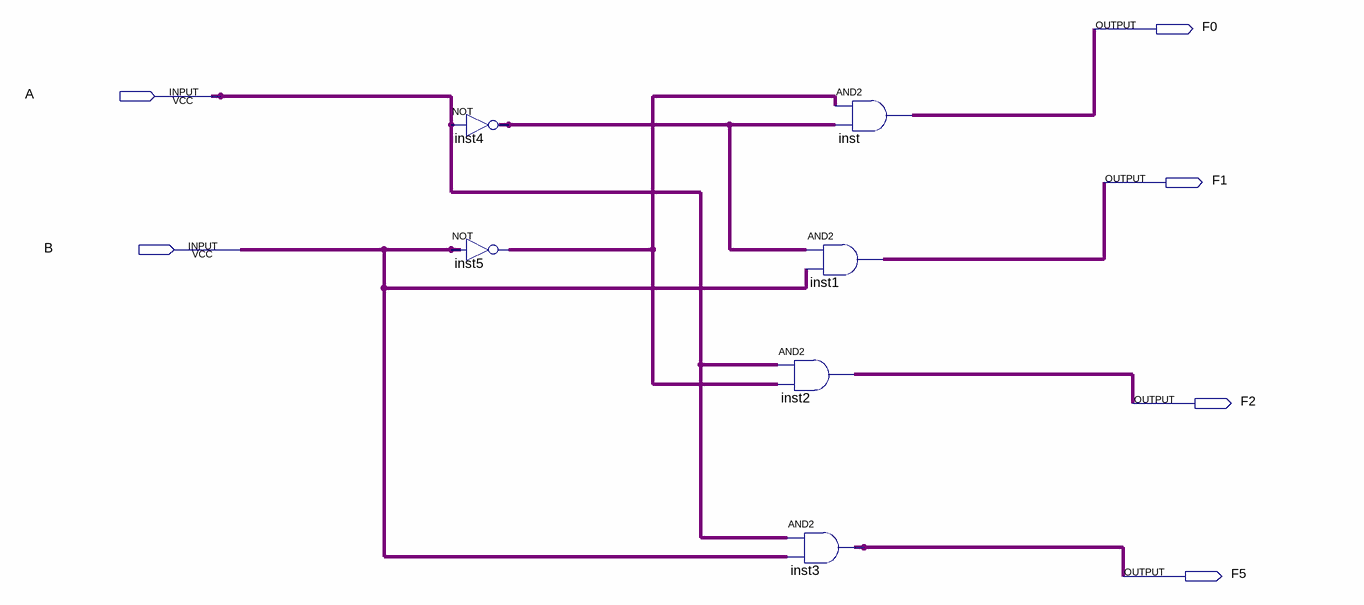
[diagram p0: schematic sheet]
// Quartus schematic Block1.bdf as structural Verilog: 6 symbols, 6 pins
module Block1 (
  input  A,
  input  B,
  output F0,
  output F1,
  output F2,
  output F5
);

  wire inst4_out, inst5_out;

  not inst4 (inst4_out, A);
  not inst5 (inst5_out, B);
  and inst1 (F1, inst4_out, B);
  and inst2 (F2, A, inst5_out);
  and inst3 (F5, A, B);
  and inst (F0, inst5_out, inst4_out);
endmodule
